# Altium project Control-Board-v1.0.PrjPcb (part 1 of 6)
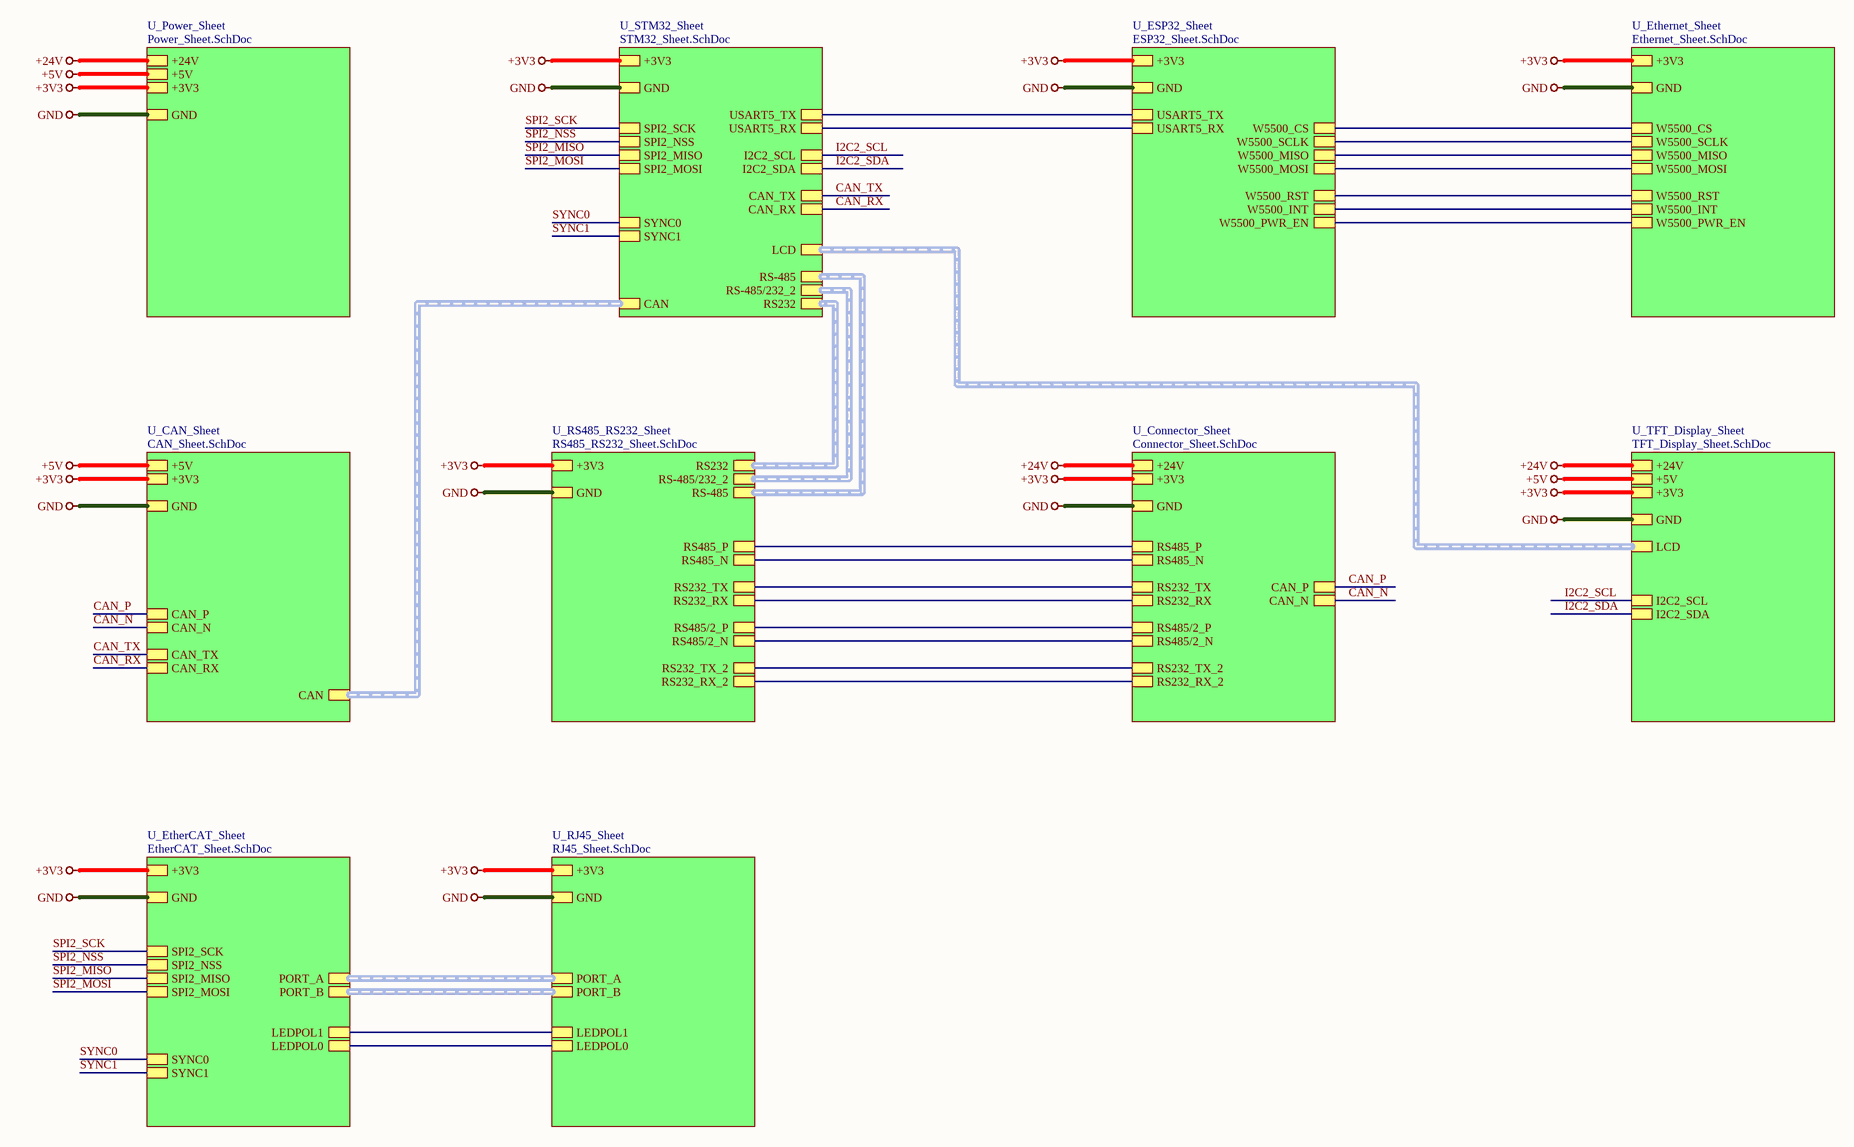
[diagram p0: Top_Sheet.SchDoc]
11 sheets, 286 parts. Net scope: hierarchical (ports join the sheet entries above them; power ports are global).
Sheets:
  Top_Sheet.SchDoc
    U_CAN_Sheet = CAN_Sheet.SchDoc
    U_Connector_Sheet = Connector_Sheet.SchDoc
    U_ESP32_Sheet = ESP32_Sheet.SchDoc
    U_EtherCAT_Sheet = EtherCAT_Sheet.SchDoc
    U_Ethernet_Sheet = Ethernet_Sheet.SchDoc
    U_Power_Sheet = Power_Sheet.SchDoc
    U_RJ45_Sheet = RJ45_Sheet.SchDoc
    U_RS485_RS232_Sheet = RS485_RS232_Sheet.SchDoc
    U_STM32_Sheet = STM32_Sheet.SchDoc
    U_TFT_Display_Sheet = TFT_Display_Sheet.SchDoc

## Sheet Top_Sheet.SchDoc
size 420 x 297 mm; SheetNumber: 1; SheetTotal: 11

### Sub-sheets
U_CAN_Sheet = CAN_Sheet.SchDoc: CAN (harness CAN), CAN_RX, CAN_TX, CAN_P, CAN_N, +5V, +3V3, GND
U_Connector_Sheet = Connector_Sheet.SchDoc: RS485/2_N, RS485/2_P, RS232_RX_2, RS232_TX_2, RS485_N, RS485_P, RS232_RX, RS232_TX, CAN_P, CAN_N, +3V3, GND, +24V
U_ESP32_Sheet = ESP32_Sheet.SchDoc: +3V3, GND, W5500_SCLK, W5500_MISO, W5500_MOSI, W5500_RST, W5500_INT, W5500_CS, W5500_PWR_EN, USART5_TX, USART5_RX
U_EtherCAT_Sheet = EtherCAT_Sheet.SchDoc: PORT_A (harness PORT_A), PORT_B (harness PORT_B), LEDPOL0, LEDPOL1, SPI2_SCK, SPI2_NSS, SPI2_MISO, SPI2_MOSI, +3V3, GND, SYNC1, SYNC0
U_Ethernet_Sheet = Ethernet_Sheet.SchDoc: W5500_SCLK, W5500_MISO, W5500_MOSI, W5500_RST, W5500_INT, W5500_CS, W5500_PWR_EN, +3V3, GND
U_Power_Sheet = Power_Sheet.SchDoc: +24V, +5V, +3V3, GND
U_RJ45_Sheet = RJ45_Sheet.SchDoc: PORT_A (harness PORT_A), PORT_B (harness PORT_B), LEDPOL0, LEDPOL1, +3V3, GND
U_RS485_RS232_Sheet = RS485_RS232_Sheet.SchDoc: RS485_N, RS485_P, RS232_RX, RS232_TX, RS-485 (harness RS-485), +3V3, GND, RS485/2_N, RS485/2_P, RS232_RX_2, RS232_TX_2, RS-485/232_2 (harness RS-485/232_2), RS232 (harness RS232)
U_STM32_Sheet = STM32_Sheet.SchDoc: SPI2_SCK, SPI2_NSS, SPI2_MISO, SPI2_MOSI, RS-485/232_2 (harness RS-485/232_2), RS232 (harness RS232), +3V3, GND, USART5_TX, USART5_RX, RS-485 (harness RS-485), CAN_RX, CAN_TX, CAN (harness CAN), LCD (harness TFT_LCD), I2C2_SCL, I2C2_SDA, SYNC1, SYNC0
U_TFT_Display_Sheet = TFT_Display_Sheet.SchDoc: +3V3, GND, LCD (harness TFT_LCD), +24V, I2C2_SCL, I2C2_SDA, +5V

### Nets
+3V3: sheet U_CAN_Sheet/+3V3, sheet U_Connector_Sheet/+3V3, sheet U_ESP32_Sheet/+3V3, sheet U_EtherCAT_Sheet/+3V3, sheet U_Ethernet_Sheet/+3V3, sheet U_Power_Sheet/+3V3, sheet U_RJ45_Sheet/+3V3, sheet U_RS485_RS232_Sheet/+3V3, sheet U_STM32_Sheet/+3V3, sheet U_TFT_Display_Sheet/+3V3
+5V: sheet U_CAN_Sheet/+5V, sheet U_Power_Sheet/+5V, sheet U_TFT_Display_Sheet/+5V
+24V: sheet U_Connector_Sheet/+24V, sheet U_Power_Sheet/+24V, sheet U_TFT_Display_Sheet/+24V
CAN_RX: sheet U_CAN_Sheet/CAN_RX, sheet U_STM32_Sheet/CAN_RX
CAN_TX: sheet U_CAN_Sheet/CAN_TX, sheet U_STM32_Sheet/CAN_TX
GND: sheet U_CAN_Sheet/GND, sheet U_Connector_Sheet/GND, sheet U_ESP32_Sheet/GND, sheet U_EtherCAT_Sheet/GND, sheet U_Ethernet_Sheet/GND, sheet U_Power_Sheet/GND, sheet U_RJ45_Sheet/GND, sheet U_RS485_RS232_Sheet/GND, sheet U_STM32_Sheet/GND, sheet U_TFT_Display_Sheet/GND
RS232_RX: sheet U_Connector_Sheet/RS232_RX, sheet U_RS485_RS232_Sheet/RS232_RX
RS232_RX_2: sheet U_Connector_Sheet/RS232_RX_2, sheet U_RS485_RS232_Sheet/RS232_RX_2
RS232_TX: sheet U_Connector_Sheet/RS232_TX, sheet U_RS485_RS232_Sheet/RS232_TX
RS232_TX_2: sheet U_Connector_Sheet/RS232_TX_2, sheet U_RS485_RS232_Sheet/RS232_TX_2
W5500_RST: sheet U_ESP32_Sheet/W5500_RST, sheet U_Ethernet_Sheet/W5500_RST
CAN_N: sheet U_CAN_Sheet/CAN_N, sheet U_Connector_Sheet/CAN_N
CAN_P: sheet U_CAN_Sheet/CAN_P, sheet U_Connector_Sheet/CAN_P
I2C2_SCL: sheet U_STM32_Sheet/I2C2_SCL, sheet U_TFT_Display_Sheet/I2C2_SCL
I2C2_SDA: sheet U_STM32_Sheet/I2C2_SDA, sheet U_TFT_Display_Sheet/I2C2_SDA
LEDPOL0: sheet U_EtherCAT_Sheet/LEDPOL0, sheet U_RJ45_Sheet/LEDPOL0
LEDPOL1: sheet U_EtherCAT_Sheet/LEDPOL1, sheet U_RJ45_Sheet/LEDPOL1
RS485/2_N: sheet U_Connector_Sheet/RS485/2_N, sheet U_RS485_RS232_Sheet/RS485/2_N
RS485/2_P: sheet U_Connector_Sheet/RS485/2_P, sheet U_RS485_RS232_Sheet/RS485/2_P
RS485_N: sheet U_Connector_Sheet/RS485_N, sheet U_RS485_RS232_Sheet/RS485_N
RS485_P: sheet U_Connector_Sheet/RS485_P, sheet U_RS485_RS232_Sheet/RS485_P
SPI2_CS_IO5: sheet U_ESP32_Sheet/W5500_CS, sheet U_Ethernet_Sheet/W5500_CS
SPI2_MISO: sheet U_EtherCAT_Sheet/SPI2_MISO, sheet U_STM32_Sheet/SPI2_MISO
SPI2_MISO_IO1: sheet U_ESP32_Sheet/W5500_MISO, sheet U_Ethernet_Sheet/W5500_MISO
SPI2_MOSI: sheet U_EtherCAT_Sheet/SPI2_MOSI, sheet U_STM32_Sheet/SPI2_MOSI
SPI2_MOSI_IO2: sheet U_ESP32_Sheet/W5500_MOSI, sheet U_Ethernet_Sheet/W5500_MOSI
SPI2_NSS: sheet U_EtherCAT_Sheet/SPI2_NSS, sheet U_STM32_Sheet/SPI2_NSS
SPI2_SCK: sheet U_EtherCAT_Sheet/SPI2_SCK, sheet U_STM32_Sheet/SPI2_SCK
SPI2_SCK_IO4: sheet U_ESP32_Sheet/W5500_SCLK, sheet U_Ethernet_Sheet/W5500_SCLK
SYNC0: sheet U_EtherCAT_Sheet/SYNC0, sheet U_STM32_Sheet/SYNC0
SYNC1: sheet U_EtherCAT_Sheet/SYNC1, sheet U_STM32_Sheet/SYNC1
USART5_RX: sheet U_ESP32_Sheet/USART5_RX, sheet U_STM32_Sheet/USART5_RX
USART5_TX: sheet U_ESP32_Sheet/USART5_TX, sheet U_STM32_Sheet/USART5_TX
W5500_INT: sheet U_ESP32_Sheet/W5500_INT, sheet U_Ethernet_Sheet/W5500_INT
W5500_PWR_EN: sheet U_ESP32_Sheet/W5500_PWR_EN, sheet U_Ethernet_Sheet/W5500_PWR_EN

### Buses and harness runs
harness sheet U_CAN_Sheet/CAN = sheet U_STM32_Sheet/CAN
harness sheet U_EtherCAT_Sheet/PORT_A = sheet U_RJ45_Sheet/PORT_A
harness sheet U_EtherCAT_Sheet/PORT_B = sheet U_RJ45_Sheet/PORT_B
harness sheet U_RS485_RS232_Sheet/RS232 = sheet U_STM32_Sheet/RS232
harness sheet U_RS485_RS232_Sheet/RS-485 = sheet U_STM32_Sheet/RS-485
harness sheet U_RS485_RS232_Sheet/RS-485/232_2 = sheet U_STM32_Sheet/RS-485/232_2
harness sheet U_STM32_Sheet/LCD = sheet U_TFT_Display_Sheet/LCD

### Notes on the sheet
- File:
- Title:
- Date:
- Page
- Num:
- Total:
- Drawn By: Huzaifa Ali

## Sheet CAN_Sheet.SchDoc
size 420 x 297 mm; SheetNumber: 5; SheetTotal: 11
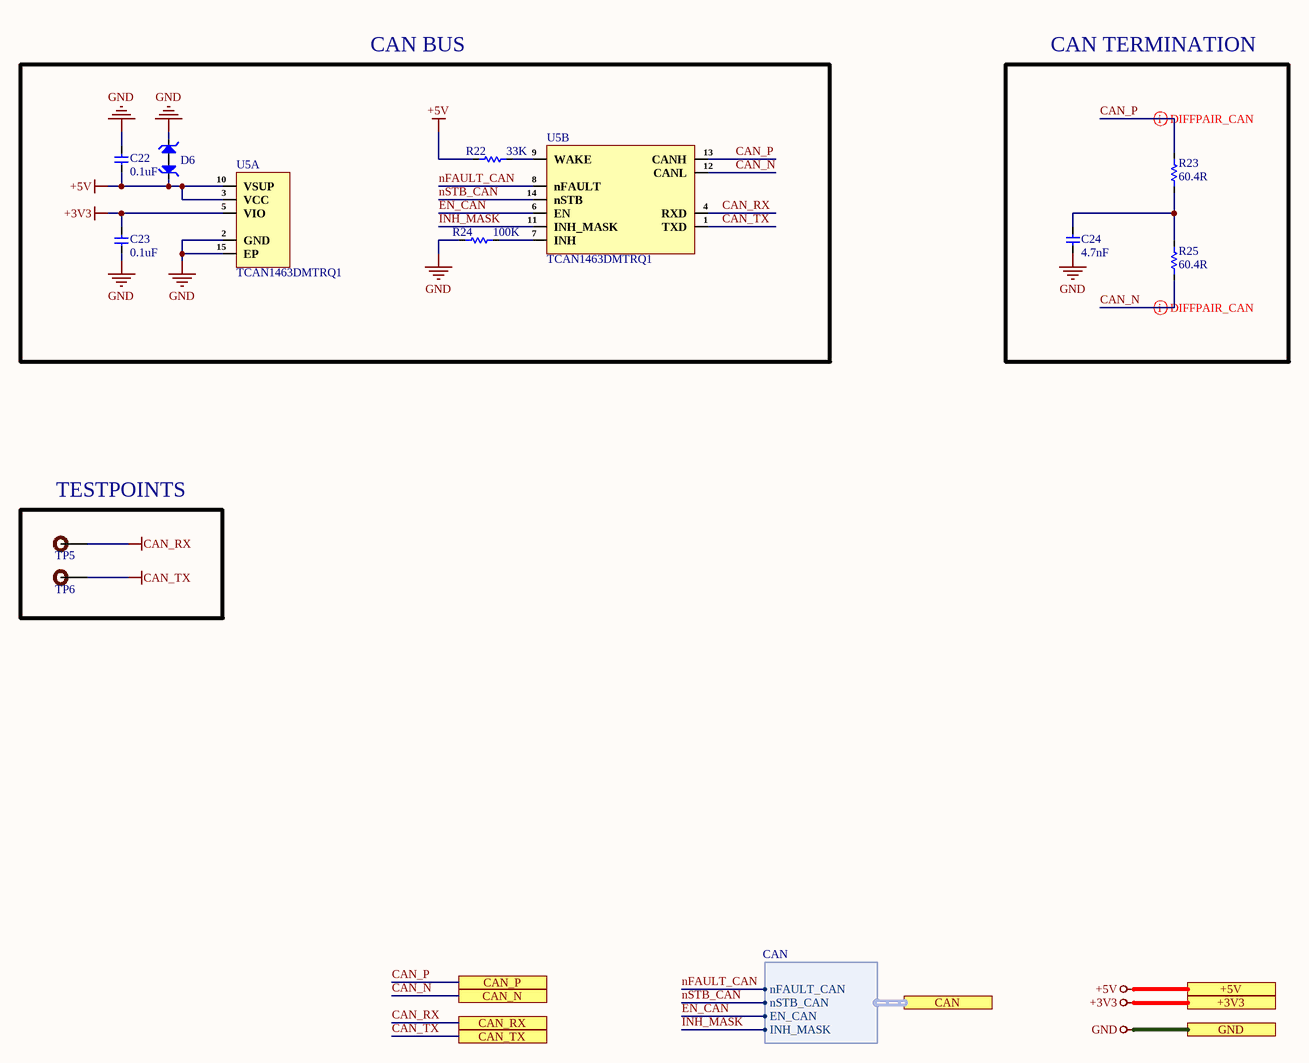
[diagram p1: CAN_Sheet.SchDoc]

### Parts
C22  0.1uF  [Cap-0402]
C23  0.1uF  [Cap-0402]
C24  4.7nF  [Cap-0402]
D6  PESD5V0H1BSFYL  [DSN0603-2]  (value not drawn)
R22  33K  [Res-0402]
R23  60.4R  [Res-0603]
R24  100K  [Res-0402]
R25  60.4R  [Res-0603]
TP5  TEST POINT  [Test-point]  (value not drawn)  (no BOM)
TP6  TEST POINT  [Test-point]  (value not drawn)  (no BOM)
U5  TCAN1463DMTRQ1  [VSON-14(3x4.5)]  (parts A,B of 2)

### Ports
+3V3 (see Top_Sheet[1B], Connector_Sheet[5D], ESP32_Sheet[5D], EtherCAT_Sheet[5D], Ethernet_Sheet[5D], Power_Sheet[5D], RJ45_Sheet[5D], RS485_RS232_Sheet[5D], STM32_Sheet[5D], TFT_Display_Sheet[5D]), +5V (see Top_Sheet[1B], Power_Sheet[5D]), CAN (harness CAN, see Top_Sheet[2C], STM32_Sheet[4D]), CAN_N (see Top_Sheet[1C], Connector_Sheet[3D]), CAN_P (see Top_Sheet[1C], Connector_Sheet[3D]), CAN_RX (see Top_Sheet[1C], STM32_Sheet[2D]), CAN_TX (see Top_Sheet[1C], STM32_Sheet[2D]), GND (see Top_Sheet[1B], Connector_Sheet[5D], ESP32_Sheet[5D], EtherCAT_Sheet[5D], Ethernet_Sheet[5D], Power_Sheet[5D], RJ45_Sheet[5D], RS485_RS232_Sheet[5D], STM32_Sheet[5D], TFT_Display_Sheet[5D])

### Harnesses
CAN: nFAULT_CAN, nSTB_CAN, EN_CAN, INH_MASK

### Nets
+3V3: C23.2 U5.5(VIO) ; port +3V3
+5V: C22.1 D6.1 R22.1 U5.3(VCC) U5.10(VSUP) ; port +5V
CAN_RX: TP5.1 U5.4(RXD) ; port CAN_RX
CAN_TX: TP6.1 U5.1(TXD) ; port CAN_TX
GND: C22.2 C23.1 C24.2 D6.2 R24.1 U5.2(GND) U5.15(EP) ; port GND
CAN_N: R25.2 U5.12(CANL) ; port CAN_N
CAN_P: R23.1 U5.13(CANH) ; port CAN_P
EN_CAN: U5.6(EN) ; port CAN.EN_CAN
INH_MASK: U5.11(INH_MASK) ; port CAN.INH_MASK
nFAULT_CAN: U5.8(nFAULT) ; port CAN.nFAULT_CAN
nSTB_CAN: U5.14(nSTB) ; port CAN.nSTB_CAN
NetC24_1: C24.1 R23.2 R25.1
NetR22_2: R22.2 U5.9(WAKE)
NetR24_2: R24.2 U5.7(INH)

### Layout directives
differential pair; net class CAN; differential pair class CAN_Lines: CAN_N, CAN_P

### Notes on the sheet
- CAN BUS
- CAN TERMINATION
- (near TP5) TESTPOINTS
- File:
- Title:
- Date:
- Page
- Num:
- Total:
- Drawn By: Huzaifa Ali

### Library data of the parts
C22 C23 = CC0402JRX7R7BB104: CAP CER 0.1UF 16V X7R 0402; Manufacturer: Yageo; Material: 4241ConductorMaterial; Value: 100nF; Tolerance: 5%; Item Type: Capacitor; Supplier: Digikey; Supplier Part Number: 311-1676-1-ND; Manufacturer Part Number: CC0402JRX7R7BB104; RoHS: Yes; Category: Ceramic Capacitors; Stock: 1659111; Pricing: 1=0.1, 10=0.046, 50=0.0262, 100=0.0203, 500=0.01528, 1000=0.012, 2500=0.01091, 5000=0.01004 (USD); Mounting Technology: Surface Mount; Case/Package: 0402; Case Code (Metric): 1005; Case Code (Imperial): 0402; Min Operating Temperature: -55°C; Max Operating Temperature: 125°C; Dielectric: X7R; Packaging: Tape and Reel; Package Quantity: 10000; Voltage Rating (DC): 16V; Voltage Rating: 16V; Series: CC; Construction: Flat; Length: 0.039inch; Width: 0.02inch; Height: 0.5mm; Thickness: 0.022inch; Lead Free: Lead Free; Halogen Free: Halogen Free; RoHS Compliant: Yes; ComponentLink1URL: https://datasheet.ciiva.com/13210/upy-gphc-x7r-6-3v-to-50v-8-12304-13210152.pdf?src-supplier=Mouser; ComponentLink1Description: https://datasheet.ciiva.com/13210/upy-gphc-x7r-6-3v-to-50v-8-12304-13210152.pdf?src-supplier=Mouser; LCSC Part Number: C541464
C24 = CC0402KRX7R9BB472: CAP CER 4700PF 50V X7R 0402; Manufacturer: Yageo; Material: 4241ConductorMaterial; Tolerance: 10%; Temperature Coefficient: 30ppm/°C; Item Type: Capacitor; Supplier 1: Future Electronics; Manufacturer Part Number: CC0402KRX7R9BB472; RoHS: Yes; Category: Ceramic Capacitors; Stock 1: 1780000; Pricing 1: 10000=0.0021, 40000=0.002, 150000=0.0019, 400000=0.0018, 1000000=0.0017 (USD); Mount: Surface Mount; Case/Package: 0402; Number of Pins: 2NUMBER; Case Code (Imperial): 0402; Case Code (Metric): 1005; Min Operating Temperature: -55°C; Max Operating Temperature: 125°C; Capacitance: 4.7nF; Dielectric: X7R; Voltage Rating: 50V; Voltage Rating (DC): 50V; Packaging: Tape and Reel; Package Quantity: 1; Termination: SMD/SMT; Series: CC; Construction: Flat; Length: 1mm; Width: 0.02inch; Height: 0.5mm; Thickness: 0.022inch; Depth: 0.5mm; Radiation Hardening: No; Reach SVHC Compliant: No; RoHS Compliant: Yes; Halogen Free: 5694HalogenFree; Lead Free: 5697LeadFree; ComponentLink1URL: https://datasheet.ciiva.com/7978/1489800-7978108.pdf?src-supplier=Element14; ComponentLink1Description: https://datasheet.ciiva.com/7978/1489800-7978108.pdf?src-supplier=Element14; ComponentLink2URL: https://datasheet.ciiva.com/176/mlccorderingcode-176364.pdf?src-supplier=Digikey; ComponentLink2Description: https://datasheet.ciiva.com/176/mlccorderingcode-176364.pdf?src-supplier=Digikey; ComponentLink3URL: https://datasheet.ciiva.com/176/mlccorderingcode-176363.pdf?src-supplier=Digikey; ComponentLink3Description: https://datasheet.ciiva.com/176/mlccorderingcode-176363.pdf?src-supplier=Digikey; ComponentLink4URL: https://datasheet.ciiva.com/176/mlccorderingcode-176365.pdf?src-supplier=Digikey; ComponentLink4Description: https://datasheet.ciiva.com/176/mlccorderingcode-176365.pdf?src-supplier=Digikey; ComponentLink5URL: https://datasheet.ciiva.com/11586/upy-gphc-x7r-6-3v-to-50v-8-11586491.pdf?src-supplier=Avnet; ComponentLink5Description: https://datasheet.ciiva.com/11586/upy-gphc-x7r-6-3v-to-50v-8-11586491.pdf?src-supplier=Avnet; Supplier Part Number 1: 1989300
D6 = PESD5V0H1BSFYL: TVS DIODE 5VWM 6.3VC DSN0603-2; Manufacturer: Nexperia; Supplier 1: Avnet; Manufacturer Part Number: PESD5V0H1BSFYL; RoHS: Yes; Category: ESD and Circuit Protection ICs; Stock 1: 9000; Pricing 1: 18000=0.06453, 36000=0.06278, 54000=0.06104, 90000=0.05930, 180000=0.05755, 900000=0.05581, 1800000=0.05406 (USD); RoHS Compliant: Yes; ComponentLink1URL: http://www.farnell.com/datasheets/1961312.pdf?src-supplier=Farnell; ComponentLink1Description: http://www.farnell.com/datasheets/1961312.pdf?src-supplier=Farnell; ComponentLink2URL: https://assets.nexperia.com/documents/data-sheet/PESD5V0H1BSF.pdf?src-supplier=Digi-Key; ComponentLink2Description: https://assets.nexperia.com/documents/data-sheet/PESD5V0H1BSF.pdf?src-supplier=Digi-Key; ComponentLink3URL: http://www.farnell.com/datasheets/1961312.pdf?src-supplier=Newark; ComponentLink3Description: http://www.farnell.com/datasheets/1961312.pdf?src-supplier=Newark; Supplier Part Number 1: PESD5V0H1BSFYL; LCSC Part Number: C477989; Item Type: Diode
R22 = RC0402FR-0733KL: RES 33K OHM 1% 1/16W 0402; Manufacturer: YAGEO; Item Type: Resistor; Manufacturer Part Number: RC0402FR-0733KL; Package: 0402; LCSC Part Number: C138003; ComponentLink1Description: LCSC; ComponentLink1URL: https://www.lcsc.com/product-detail/Chip-Resistor-Surface-Mount_YAGEO-RC0402FR-0733KL_C138003.html
R23 R25 = RTT0360R4FTP: 100mW Thick Film Resistors ±100ppm/℃ ±1% 60.4Ω 0603 Chip Resistor - Surface Mount ROHS; Manuacturer: RALEC; Manufacturer Part Number: RTT0360R4FTP; Package: 0603; Value: 60.4R; LCSC Part Number: C103744; ComponentLink1Description: LCSC; ComponentLink1URL: https://www.lcsc.com/product-detail/Chip-Resistor-Surface-Mount_RALEC-RTT0360R4FTP_C103744.html
R24 = RC0402FR-07100KL: RES 100K OHM 1% 1/16W 0402; Manufacturer: Yageo; Resistance: 100kR; Temperature Coefficient: 100ppm/°C; Power Rating: 63mW; Voltage Rating: 50V; Item Type: Resistor; Supplier 1: Mouser; Manufacturer Part Number: RC0402FR-07100KL; RoHS: Yes; Category: Chip SMD Resistors; Stock 1: 7759549; Pricing 1: 1=0.10000, 10=0.01200, 50=0.01200, 100=0.00500, 1000=0.00300, 2500=0.00200, 10000=0.00100 (USD); Case/Package: 0402; Case Code (Metric): 1005; Case Code (Imperial): 0402; Min Operating Temperature: -55°C; Max Operating Temperature: 155°C; Resistor Type: Thick Film; Tolerance: 1%; Packaging: Tape and Reel; Package Quantity: 1; Number of Terminations: 2; Termination: SMD/SMT; Max Power Dissipation: 63mW; Working Voltage: 50V; Features: Moisture Resistant; Series: RC; Resistance Tolerance: 1%; Construction: Rectangular; Technology: THICK FILM; Length: 0.039inch; Width: 0.02inch; Height: 0.016inch; Depth: 0.5mm; REACH SVHC: No SVHC; Lead Free: Lead Free; RoHS Compliant: Yes; Military Standard: Not; ComponentLink1URL: https://datasheet.ciiva.com/11819/0900766b80c66297-11819452.pdf?src-supplier=RSComponents; ComponentLink1Description: https://datasheet.ciiva.com/11819/0900766b80c66297-11819452.pdf?src-supplier=RSComponents; ComponentLink2URL: https://datasheet.ciiva.com/22747/1018594-22747509.pdf?src-supplier=Element14; ComponentLink2Description: https://datasheet.ciiva.com/22747/1018594-22747509.pdf?src-supplier=Element14; ComponentLink3URL: https://datasheet.ciiva.com/2453/pyu-r-int-thick-7-2453362.pdf?src-supplier=Digi-Key; ComponentLink3Description: https://datasheet.ciiva.com/2453/pyu-r-int-thick-7-2453362.pdf?src-supplier=Digi-Key; ComponentLink4URL: https://datasheet.ciiva.com/2453/pyu-r-int-thick-7-2453363.pdf?src-supplier=Digi-Key; ComponentLink4Description: https://datasheet.ciiva.com/2453/pyu-r-int-thick-7-2453363.pdf?src-supplier=Digi-Key; ComponentLink5URL: https://datasheet.ciiva.com/2453/pyu-r-int-thick-7-2453361.pdf?src-supplier=Digi-Key; ComponentLink5Description: https://datasheet.ciiva.com/2453/pyu-r-int-thick-7-2453361.pdf?src-supplier=Digi-Key; ComponentLink6URL: https://datasheet.ciiva.com/12667/pyu-rc0402-51-rohs-l-6-r-12667930.pdf?src-supplier=Mouser; ComponentLink6Description: https://datasheet.ciiva.com/12667/pyu-rc0402-51-rohs-l-6-r-12667930.pdf?src-supplier=Mouser; ComponentLink7URL: https://datasheet.ciiva.com/15189/getdatasheetpartid-323696-15189334.pdf?src-supplier=Verical; ComponentLink7Description: https://datasheet.ciiva.com/15189/getdatasheetpartid-323696-15189334.pdf?src-supplier=Verical; Supplier Part Number 1: 603-RC0402FR-07100KL; LCSC Part Number: C60491
TP5 TP6 = TEST POINT: Test Point ON; Item Type: TEST POINT
U5 = TCAN1463DMTRQ1: IC TRANSCEIVER HALF 1/1 14VSON; Manufacturer: Texas Instruments; Supplier: Mouser; Supplier Part Number: 595-TCAN1463DMTRQ1; Manufacturer Part Number: TCAN1463DMTRQ1; RoHS: Yes; Item Type: IC; Stock: 20610; Pricing: 1=2.47, 10=2.22, 50=2.22, 100=1.78, 1000=1.21, 10000=1.09 (USD); LCSC Part Number: C5215823

## Sheet Connector_Sheet.SchDoc
size 420 x 297 mm; SheetNumber: 11; SheetTotal: 11
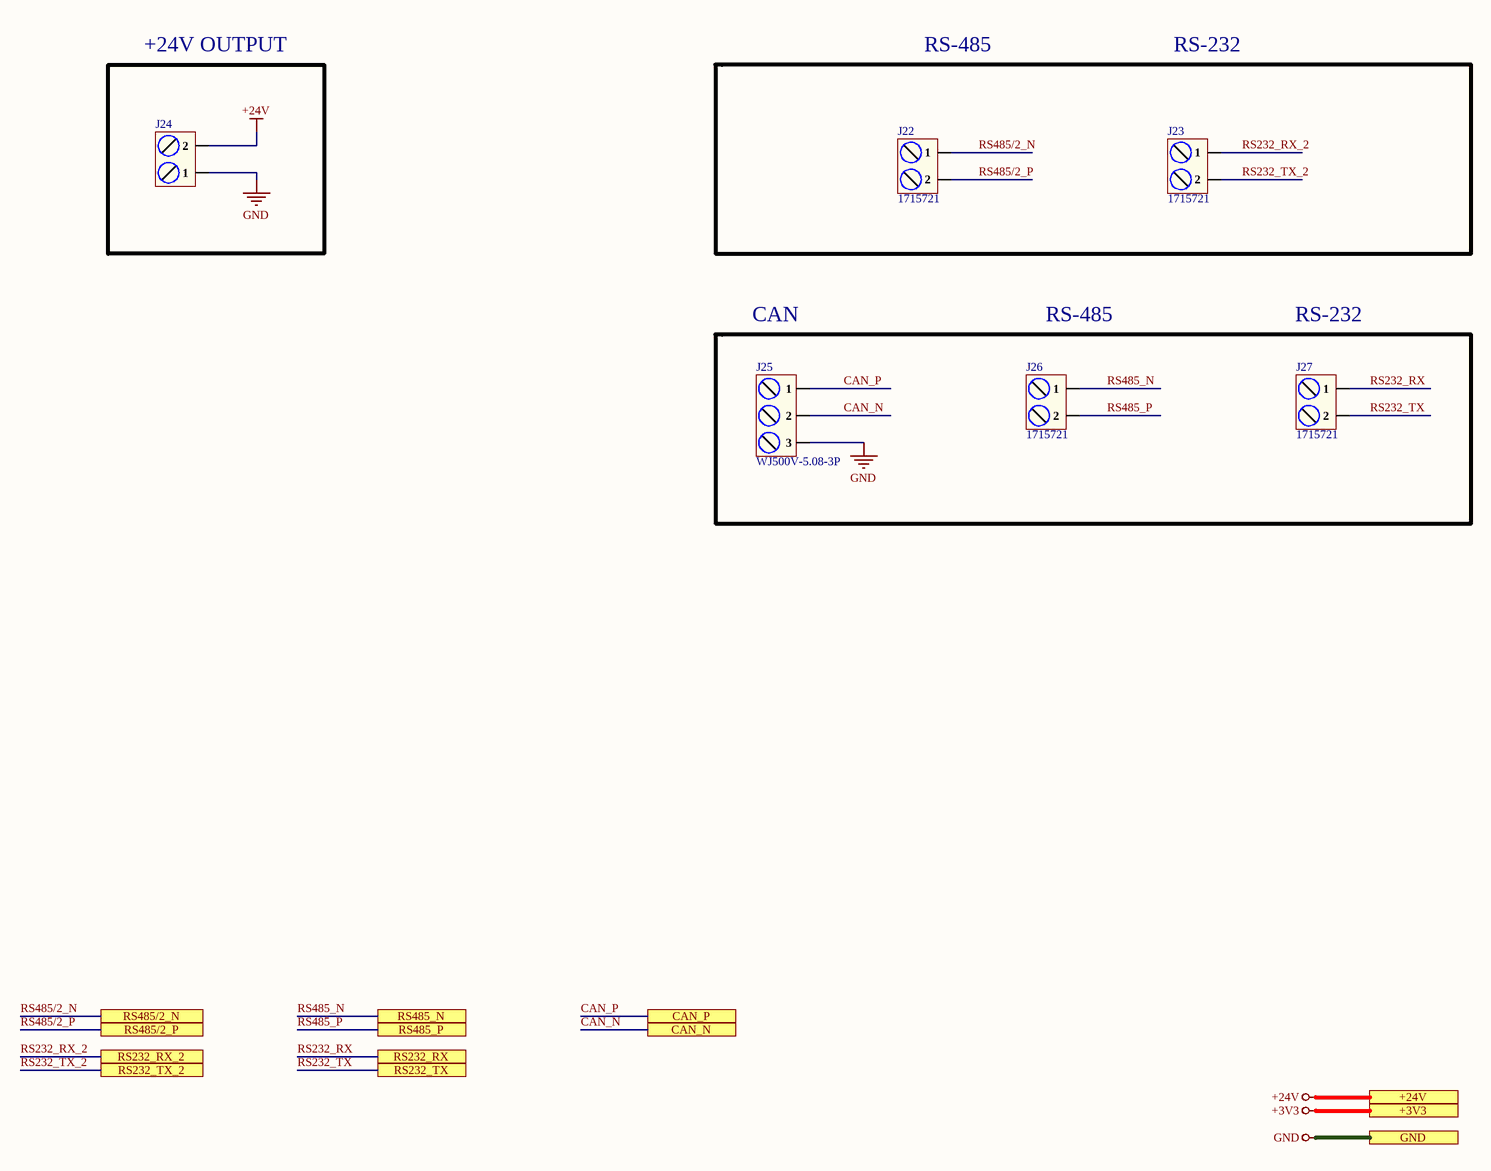
[diagram p2: Connector_Sheet.SchDoc]

### Parts
J22  1715721  [1715721]
J23  1715721  [1715721]
J24  MXHB9500-9.5-02P-BK01-Cu-S-A  [MXHB9500-9.5-02P-BK01-Cu-S-A]  (value not drawn)
J25  WJ500V-5.08-3P  [WJ500V-5.08-3P]
J26  1715721  [1715721]
J27  1715721  [1715721]

### Ports
+3V3 (see Top_Sheet[4B], CAN_Sheet[5D], ESP32_Sheet[5D], EtherCAT_Sheet[5D], Ethernet_Sheet[5D], Power_Sheet[5D], RJ45_Sheet[5D], RS485_RS232_Sheet[5D], STM32_Sheet[5D], TFT_Display_Sheet[5D]), +24V (see Top_Sheet[4B], Power_Sheet[5D]), CAN_N (see Top_Sheet[4B], CAN_Sheet[3D]), CAN_P (see Top_Sheet[4B], CAN_Sheet[3D]), GND (see Top_Sheet[4B], CAN_Sheet[5D], ESP32_Sheet[5D], EtherCAT_Sheet[5D], Ethernet_Sheet[5D], Power_Sheet[5D], RJ45_Sheet[5D], RS485_RS232_Sheet[5D], STM32_Sheet[5D], TFT_Display_Sheet[5D]), RS232_RX (see Top_Sheet[4B], RS485_RS232_Sheet[2D]), RS232_RX_2 (see Top_Sheet[4C], RS485_RS232_Sheet[1D]), RS232_TX (see Top_Sheet[4B], RS485_RS232_Sheet[2D]), RS232_TX_2 (see Top_Sheet[4C], RS485_RS232_Sheet[1D]), RS485/2_N (see Top_Sheet[4C], RS485_RS232_Sheet[1D]), RS485/2_P (see Top_Sheet[4C], RS485_RS232_Sheet[1D]), RS485_N (see Top_Sheet[4B], RS485_RS232_Sheet[2D]), RS485_P (see Top_Sheet[4B], RS485_RS232_Sheet[2D])

### Nets
+24V: J24.2 ; port +24V
GND: J24.1 J25.3 ; port GND
RS232_RX: J27.1 ; port RS232_RX
RS232_RX_2: J23.1 ; port RS232_RX_2
RS232_TX: J27.2 ; port RS232_TX
RS232_TX_2: J23.2 ; port RS232_TX_2
CAN_N: J25.2 ; port CAN_N
CAN_P: J25.1 ; port CAN_P
RS485/2_N: J22.1 ; port RS485/2_N
RS485/2_P: J22.2 ; port RS485/2_P
RS485_N: J26.1 ; port RS485_N
RS485_P: J26.2 ; port RS485_P

### Notes on the sheet
- +24V OUTPUT
- RS-485
- RS-232
- CAN
- File:
- Title:
- Date:
- Page
- Num:
- Total:
- Drawn By: Huzaifa Ali

### Library data of the parts
J22 J23 J26 J27 = 1715721: TERM BLK 2P SIDE ENT 5.08MM PCB; Manufacturer: Phoenix Contact; Item Type: Terminal Blocks; Supplier: Digikey; Supplier Part Number: 277-1263-ND; Manufacturer Part Number: 1715721; RoHS: Yes; Stock: 13160; Pricing: 1=0.94 (USD); ComponentLink1URL: https://datasheet.ciiva.com/1120/1697161-1120393.pdf?src-supplier=Farnell; ComponentLink1Description: https://datasheet.ciiva.com/1120/1697161-1120393.pdf?src-supplier=Farnell; ComponentLink2URL: https://datasheet.ciiva.com/832/1715721-832095.pdf?src-supplier=Digikey; ComponentLink2Description: https://datasheet.ciiva.com/832/1715721-832095.pdf?src-supplier=Digikey; ComponentLink3URL: https://datasheet.ciiva.com/15169/getdatasheetpartid-212174-15169929.pdf?src-supplier=Verical; ComponentLink3Description: https://datasheet.ciiva.com/15169/getdatasheetpartid-212174-15169929.pdf?src-supplier=Verical; ComponentLink4URL: https://datasheet.ciiva.com/16046/1715721-16046034.pdf?src-supplier=Onlinecomponents.com; ComponentLink4Description: https://datasheet.ciiva.com/16046/1715721-16046034.pdf?src-supplier=Onlinecomponents.com
J24 = MXHB9500-9.5-02P-BK01-Cu-S-A: Tin 1x2P Corner pin Three sides 2 1 9.5mm -40℃~+105℃ 20A 300V Black 10~22 Copper Alloy 0.5~4 Plugin,P=9.5mm Barrier Terminal Blocks ROHS; Manufacturer: MAX; Manufacturer Part Number: MXHB9500-9.5-02P-BK01-Cu-S-A; Package: Plugin,P=9.5mm; LCSC Part Number: C7542168; Item Type: Terminal Block; ComponentLink1Description: LCSC; ComponentLink1URL: https://www.lcsc.com/product-detail/Barrier-Terminal-Blocks_MAX-MXHB9500-9-5-02P-BK01-Cu-S-A_C7542168.html
J25 = WJ500V-5.08-3P: 1x3P 18A -40℃~+105℃ 250V Green 14~30 Straight pin 5.08mm 2.5 1 3 Plugin,P=5.08mm Screw terminal ROHS; Manufacturer: Ningbo Kangnex Elec; Item Type: Terminal Block; Manufacturer Part Number: WJ500V-5.08-3P; Package: Plugin,P=5.08mm; LCSC Part Number: C72334; ComponentLink1Description: LCSC; ComponentLink1URL: https://www.lcsc.com/product-detail/Screw-terminal_Ningbo-Kangnex-Elec-WJ500V-5-08-3P_C72334.html

## Sheet ESP32_Sheet.SchDoc
size 420 x 297 mm; SheetNumber: 3; SheetTotal: 11
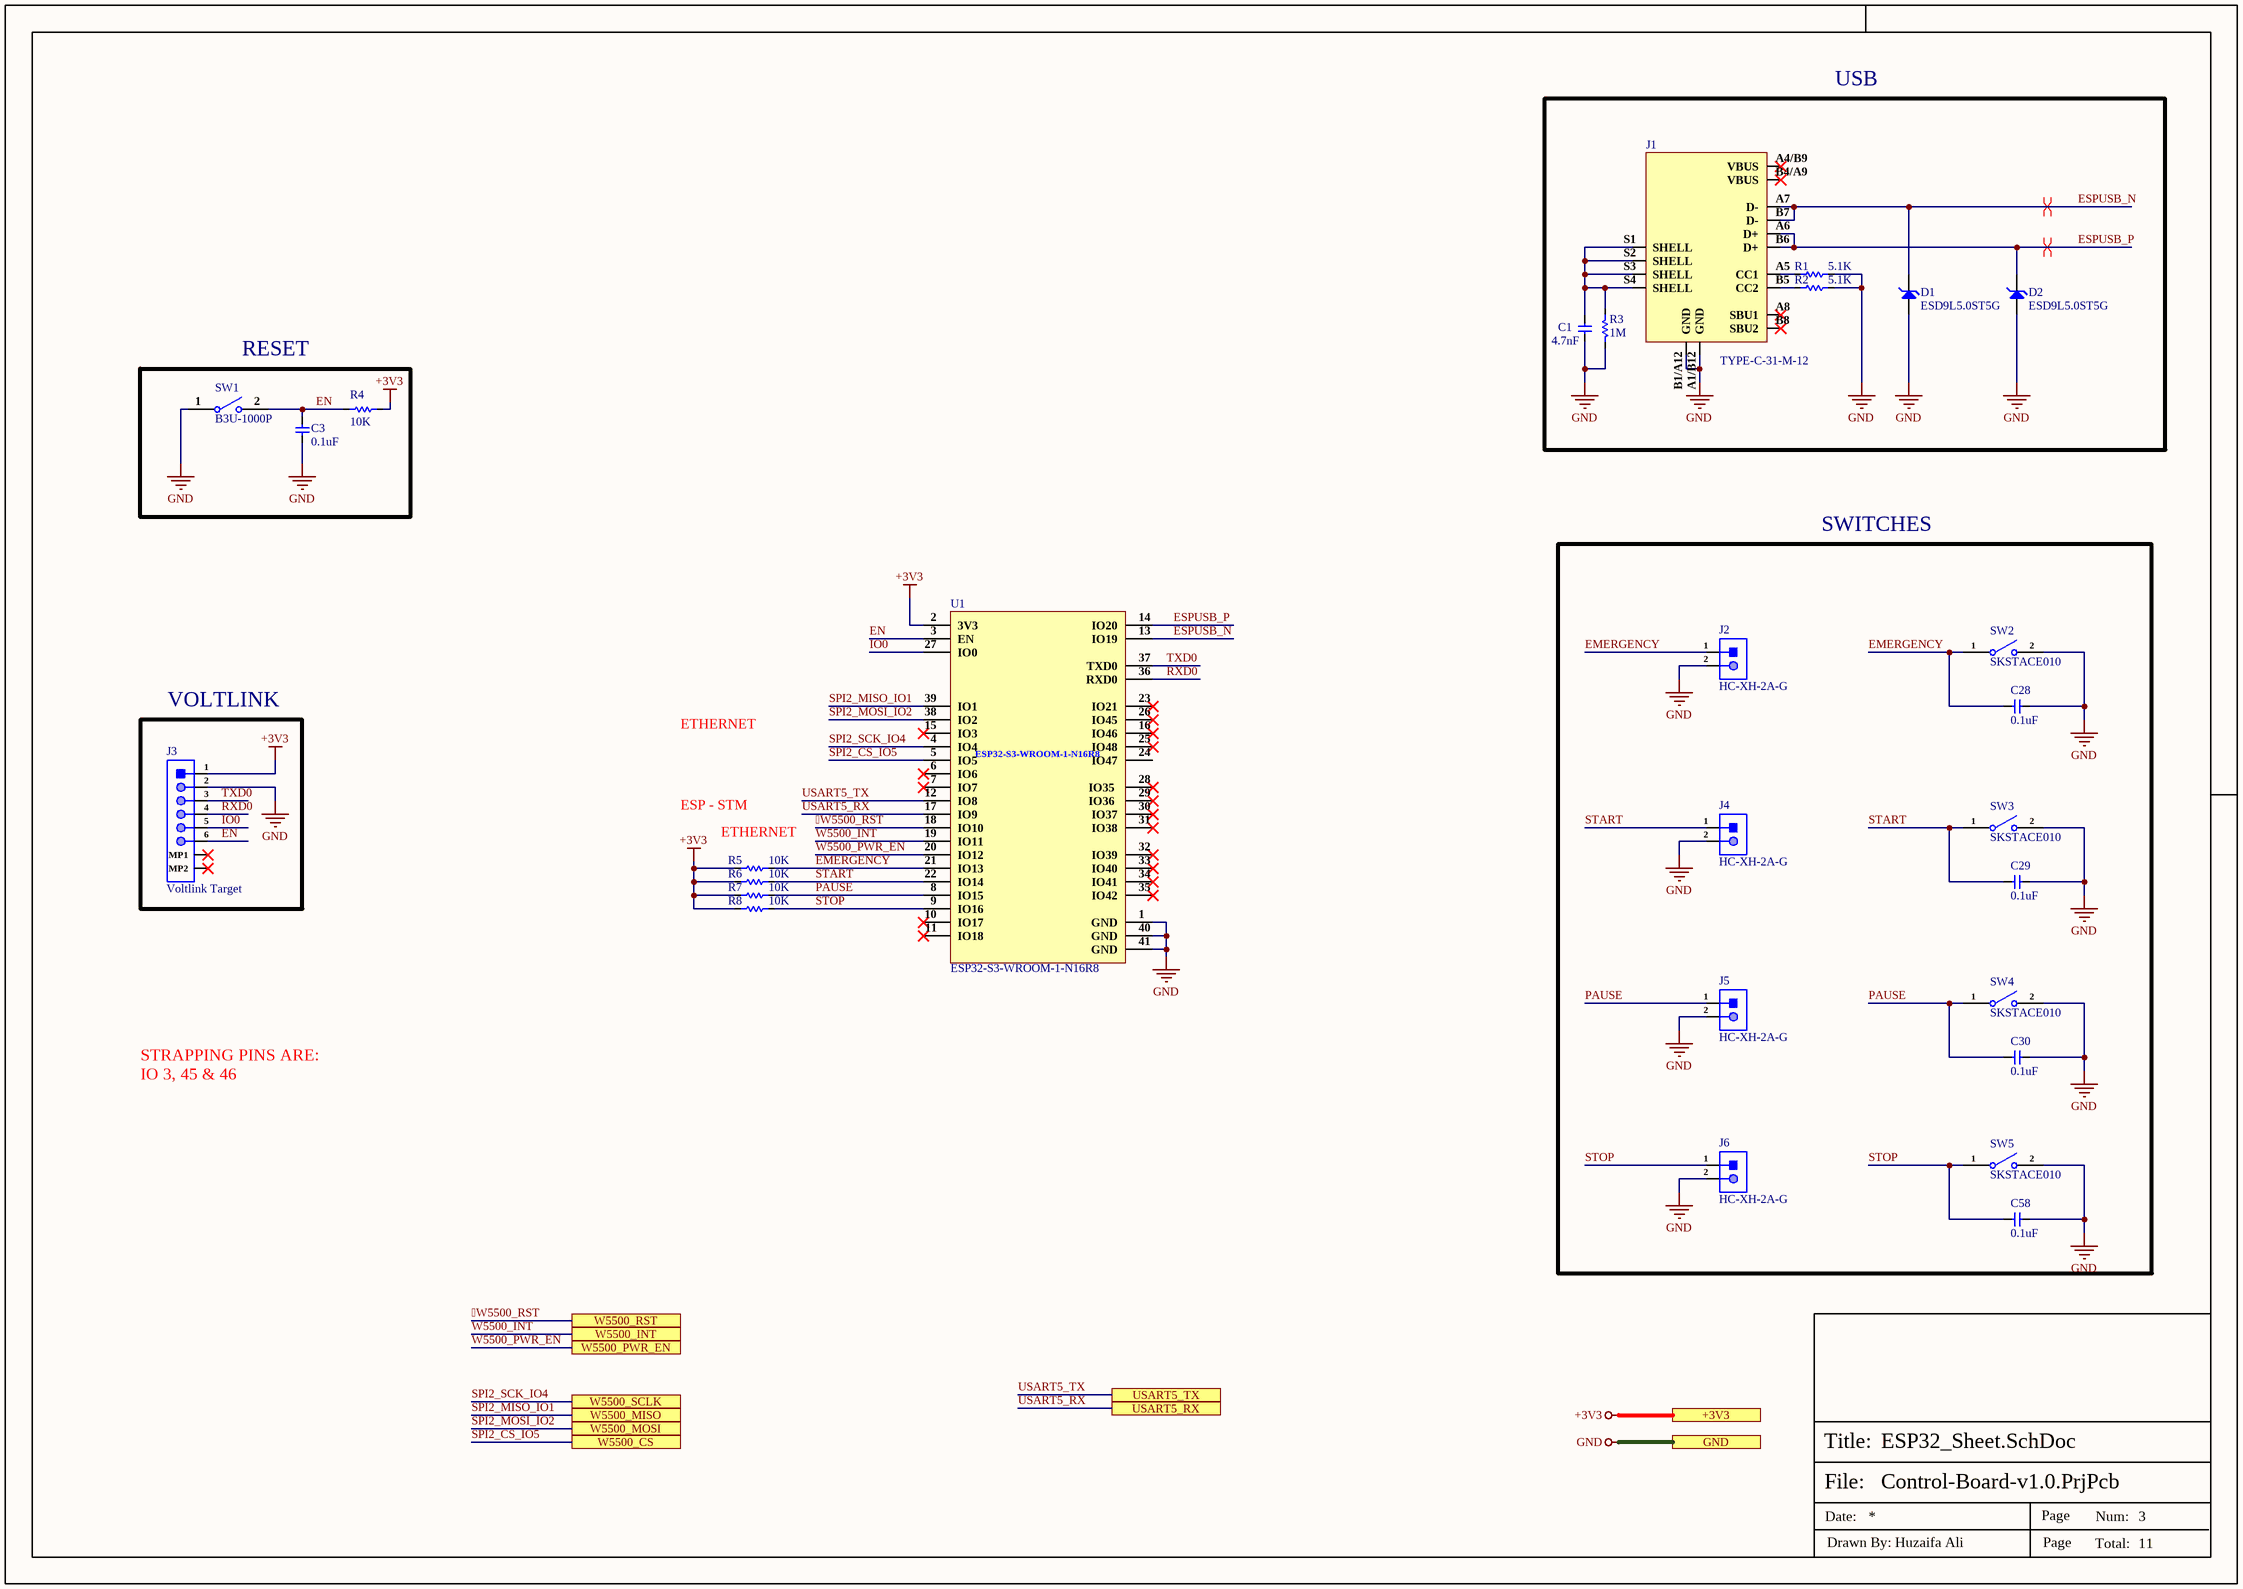
[diagram p3: ESP32_Sheet.SchDoc]

### Parts
C1  4.7nF  [Cap-0603]
C3  0.1uF  [Cap-0402]
C28  0.1uF  [Cap-0402]
C29  0.1uF  [Cap-0402]
C30  0.1uF  [Cap-0402]
C58  0.1uF  [Cap-0402]
D1  ESD9L5.0ST5G  [SOD-923.]
D2  ESD9L5.0ST5G  [SOD-923.]
J1  TYPE-C-31-M-12  [TYPE-C-31-M-12_]
J2  HC-XH-2A-G  [HC-XH-2A-G]
J3  Voltlink Target  [Voltlink Target]
J4  HC-XH-2A-G  [HC-XH-2A-G]
J5  HC-XH-2A-G  [HC-XH-2A-G]
J6  HC-XH-2A-G  [HC-XH-2A-G]
R1  5.1K  [Res-0402]
R2  5.1K  [Res-0402]
R3  1M  [Res-0402]
R4  10K  [Res-0402]
R5  10K  [Res-0402]
R6  10K  [Res-0402]
R7  10K  [Res-0402]
R8  10K  [Res-0402]
SW1  B3U-1000P  [B3U-1000P]
SW2  SKSTACE010  [SKSTACE010_]
SW3  SKSTACE010  [SKSTACE010_]
SW4  SKSTACE010  [SKSTACE010_]
SW5  SKSTACE010  [SKSTACE010_]
U1  ESP32-S3-WROOM-1-N16R8  [41-SMD Module]

### Blocks framed on the sheet
USB: C1 D1 D2 J1 R1-R3
RESET: C3 R4 SW1
SWITCHES: C28-C30 C58 J2 J4-J6 SW2-SW5
VOLTLINK: J3

### Ports
+3V3 (see Top_Sheet[4A], CAN_Sheet[5D], Connector_Sheet[5D], EtherCAT_Sheet[5D], Ethernet_Sheet[5D], Power_Sheet[5D], RJ45_Sheet[5D], RS485_RS232_Sheet[5D], STM32_Sheet[5D], TFT_Display_Sheet[5D]), GND (see Top_Sheet[4A], CAN_Sheet[5D], Connector_Sheet[5D], EtherCAT_Sheet[5D], Ethernet_Sheet[5D], Power_Sheet[5D], RJ45_Sheet[5D], RS485_RS232_Sheet[5D], STM32_Sheet[5D], TFT_Display_Sheet[5D]), USART5_RX (see Top_Sheet[4A], STM32_Sheet[3D]), USART5_TX (see Top_Sheet[4A], STM32_Sheet[3D]), W5500_CS (see Top_Sheet[4A], Ethernet_Sheet[2D]), W5500_INT (see Top_Sheet[4A], Ethernet_Sheet[3D]), W5500_MISO (see Top_Sheet[4A], Ethernet_Sheet[2D]), W5500_MOSI (see Top_Sheet[4A], Ethernet_Sheet[2D]), W5500_PWR_EN (see Top_Sheet[4B], Ethernet_Sheet[3D]), W5500_RST (see Top_Sheet[4A], Ethernet_Sheet[3D]), W5500_SCLK (see Top_Sheet[4A], Ethernet_Sheet[2D])

### Nets
+3V3: J3.1 R4.2 R5.1 R6.1 R7.1 R8.1 U1.2(3V3) ; port +3V3
GND: C1.1 C3.1 C28.1 C29.1 C30.1 C58.1 D1.2(A) D2.2(A) J1.A1/B12(GND) J1.B1/A12(GND) J2.2 J3.2 J4.2 J5.2 J6.2 R1.2 R2.2 R3.2 SW1.1 SW2.2 SW3.2 SW4.2 SW5.2 U1.1(GND) U1.40(GND) U1.41(GND) ; port GND
W5500_RST: U1.18(IO10) ; port W5500_RST
EMERGENCY: C28.2 J2.1 R5.2 SW2.1 U1.21(IO13)
EN: C3.2 J3.6 R4.1 SW1.2 U1.3(EN)
ESPUSB_N: D1.1(K) J1.A7(D-) J1.B7(D-) U1.13(IO19)
ESPUSB_P: D2.1(K) J1.A6(D+) J1.B6(D+) U1.14(IO20)
IO0: J3.5 U1.27(IO0)
PAUSE: C30.2 J5.1 R7.2 SW4.1 U1.8(IO15)
RXD0: J3.4 U1.36(RXD0)
SPI2_CS_IO5: U1.5(IO5) ; port W5500_CS
SPI2_MISO_IO1: U1.39(IO1) ; port W5500_MISO
SPI2_MOSI_IO2: U1.38(IO2) ; port W5500_MOSI
SPI2_SCK_IO4: U1.4(IO4) ; port W5500_SCLK
START: C29.2 J4.1 R6.2 SW3.1 U1.22(IO14)
STOP: C58.2 J6.1 R8.2 SW5.1 U1.9(IO16)
TXD0: J3.3 U1.37(TXD0)
USART5_RX: U1.17(IO9) ; port USART5_RX
USART5_TX: U1.12(IO8) ; port USART5_TX
W5500_INT: U1.19(IO11) ; port W5500_INT
W5500_PWR_EN: U1.20(IO12) ; port W5500_PWR_EN
NetC1_2: C1.2 J1.S1(SHELL) J1.S2(SHELL) J1.S3(SHELL) J1.S4(SHELL) R3.1
NetJ1_A5: J1.A5(CC1) R1.1
NetJ1_B5: J1.B5(CC2) R2.1

Not connected (* = marked no-connect by the designer): J1 A4/B9(VBUS)* A8(SBU1)* B4/A9(VBUS)* B8(SBU2)*; J3 MP1* MP2*; U1 6(IO6)* 7(IO7)* 10(IO17)* 11(IO18)* 15(IO3)* 16(IO46)* 23(IO21)* 24(IO47) 25(IO48)* 26(IO45)* 28(IO35_)* 29(IO36_)* 30(IO37)* 31(IO38)* 32(IO39)* 33(IO40)* 34(IO41)* 35(IO42)*

### Layout directives
differential pair; net class USB_PROGRAM; differential pair class USB_PROGRAM_LINES; rule Impedance Constraint [Min = 85.00    Max = 90.00    ]; rule Matched Net Lengths [Tolerance = 50mil]: ESPUSB_N, ESPUSB_P

### Notes on the sheet
- ETHERNET
- ESP - STM
- STRAPPING PINS ARE:
  IO 3, 45 & 46
- File:
- Title:
- Date:
- Page
- Num:
- Total:
- Drawn By: Huzaifa Ali

### Library data of the parts
C1 = CC0603JRNPO9BN472: CAP CER 4700PF 50V C0G/NPO 0603; Manufacturer: Yageo; Item Type: Capacitor; Supplier 1: Digi-Key; Manufacturer Part Number: CC0603JRNPO9BN472; RoHS: Yes; Category: Ceramic Capacitors; Stock 1: 31779; Pricing 1: 1=0.48000, 10=0.33000, 50=0.23100, 100=0.19800, 500=0.14854, 1000=0.12543 (USD); RoHS Compliant: Yes; Supplier Part Number 1: 13-CC0603JRNPO9BN472CT-ND; LCSC Part Number: C576818; ComponentLink1Description: LCSC; ComponentLink1URL: https://www.lcsc.com/product-detail/Multilayer-Ceramic-Capacitors-MLCC-SMD-SMT_YAGEO-CC0603JRNPO9BN472_C576818.html
C3 C28-C30 C58 = CC0402JRX7R7BB104: as C22 on sheet CAN_Sheet; Supplier: Digikey; Supplier Part Number: 311-1676-1-ND; Manufacturer Part Number: CC0402JRX7R7BB104; RoHS: Yes; Category: Ceramic Capacitors; Stock: 1659111; Pricing: 1=0.1, 10=0.046, 50=0.0262, 100=0.0203, 500=0.01528, 1000=0.012, 2500=0.01091, 5000=0.01004 (USD); Mounting Technology: Surface Mount; Case/Package: 0402; Case Code (Metric): 1005; Case Code (Imperial): 0402; Min Operating Temperature: -55°C; Max Operating Temperature: 125°C; Dielectric: X7R; Packaging: Tape and Reel; Package Quantity: 10000; Voltage Rating (DC): 16V; Voltage Rating: 16V; Series: CC; Construction: Flat; Length: 0.039inch; Width: 0.02inch; Height: 0.5mm; Thickness: 0.022inch; Lead Free: Lead Free; Halogen Free: Halogen Free; RoHS Compliant: Yes; ComponentLink1URL: https://datasheet.ciiva.com/13210/upy-gphc-x7r-6-3v-to-50v-8-12304-13210152.pdf?src-supplier=Mouser; ComponentLink1Description: https://datasheet.ciiva.com/13210/upy-gphc-x7r-6-3v-to-50v-8-12304-13210152.pdf?src-supplier=Mouser; LCSC Part Number: C541464
D1 D2 = ESD9L5.0ST5G: TVS DIODE 5V 9.8V SOD923; Manufacturer: ON Semiconductor; Capacitance: 0.9pF; Direction: Unidirectional; Number of Unidirectional Channels: 1; Min Breakdown Voltage: 5.4V; Power Line Protection: No; Leakage Current: 1uA; Element Configuration: Single; Peak Pulse Current: 1A; Diode Type: ZENER; Reverse Breakdown Voltage: 5.8V; Peak Pulse Power: 150mW; ESD Protection: Yes; Test Current: 1mA; Supplier 1: Digi-Key; Manufacturer Part Number: ESD9L5.0ST5G; RoHS: Yes; Category: ESD and Circuit Protection ICs; Stock 1: 558996; Pricing 1: 1=0.37000, 10=0.25600, 100=0.12500, 500=0.10426, 1000=0.07244, 2000=0.06278 (USD); Case/Package: SOD-923-2; Number of Pins: 2; Contact Plating: Tin,Matte; Min Operating Temperature: -55°C; Max Operating Temperature: 150°C; Package Quantity: 1; Packaging: Tape and Reel; Clamping Voltage: 9.8V; Reverse Standoff Voltage: 5V; Working Voltage: 5V; Resistor Type: Zener; Series: Automotive, AEC-Q101; Number of Elements: 1; Operating Supply Voltage: 5V; Max Surge Current: 1A; Breakdown Voltage: 5.4V; Number of Channels: 1; Polarity: Unidirectional; Termination: SMD/SMT; Max Reverse Leakage Current: 1uA; Max Breakdown Voltage: 5.4V; Number of Lines: 1; Power Dissipation: 150mW; Clamping Voltage-Max: 9.8V; Length: 0.8mm; Width: 0.65mm; Height: 0.4mm; Depth: 0.6mm; Radiation Hardening: No; Lead Free: Lead Free; RoHS Compliant: Yes; REACH SVHC: No SVHC; Halogen Free: Halogen Free; ComponentLink1URL: https://datasheet.ciiva.com/15143/getdatasheetpartid-185186-15143896.pdf?src-supplier=Verical; ComponentLink1Description: https://datasheet.ciiva.com/15143/getdatasheetpartid-185186-15143896.pdf?src-supplier=Verical; ComponentLink2URL: https://datasheet.ciiva.com/4510/esd9l-d-4510647.pdf?src-supplier=Mouser; ComponentLink2Description: https://datasheet.ciiva.com/4510/esd9l-d-4510647.pdf?src-supplier=Mouser; ComponentLink3URL: https://datasheet.ciiva.com/3304/esd9l-d-3304011.pdf?src-supplier=Avnet; ComponentLink3Description: https://datasheet.ciiva.com/3304/esd9l-d-3304011.pdf?src-supplier=Avnet; ComponentLink4URL: https://datasheet.ciiva.com/16437/esd9l-d-16437835.pdf?src-supplier=Future+Electronics; ComponentLink4Description: https://datasheet.ciiva.com/16437/esd9l-d-16437835.pdf?src-supplier=Future+Electronics; ComponentLink5URL: https://datasheet.ciiva.com/339/esd9l-d-339853.pdf?src-supplier=Digi-Key; ComponentLink5Description: https://datasheet.ciiva.com/339/esd9l-d-339853.pdf?src-supplier=Digi-Key; ComponentLink6URL: https://datasheet.ciiva.com/339/esd9l-d-339854.pdf?src-supplier=Digi-Key; ComponentLink6Description: https://datasheet.ciiva.com/339/esd9l-d-339854.pdf?src-supplier=Digi-Key; ComponentLink7URL: https://datasheet.ciiva.com/11195/esd9l-d-11195342.pdf?src-supplier=Avnet; ComponentLink7Description: https://datasheet.ciiva.com/11195/esd9l-d-11195342.pdf?src-supplier=Avnet; ComponentLink8URL: https://datasheet.ciiva.com/25958/esd9l-d-25958446.pdf?src-supplier=Avnet+Europe; ComponentLink8Description: https://datasheet.ciiva.com/25958/esd9l-d-25958446.pdf?src-supplier=Avnet+Europe; ComponentLink9URL: https://datasheet.ciiva.com/339/esd9l-d-339855.pdf?src-supplier=Digi-Key; ComponentLink9Description: https://datasheet.ciiva.com/339/esd9l-d-339855.pdf?src-supplier=Digi-Key; Supplier Part Number 1: ESD9L5.0ST5GOSCT-ND; LCSC Part Number: C82326
J1 = TYPE-C-31-M-12: 5A 1 16P Female Type-C SMD USB Connectors ROHS; Manufacturer: Korean Hroparts Elec; ComponentLink1Description: LCSC; ComponentLink1URL: https://www.lcsc.com/product-detail/USB-Connectors_Korean-Hroparts-Elec-TYPE-C-31-M-12_C165948.html; Manufacturer Part Number: TYPE-C-31-M-12; Footprint: Custom; LCSC Part Number: C165948; Item Type: USB Connector
J2 J4-J6 = HC-XH-2A-G: 1x2P XH 1 2.54mm 2.54mm Male pin 2 -25℃~+85℃ 3A Straight Straight,P=2.5mm Wire To Board / Wire To Wire Connector ROHS; Manufacturer: HCTL; Item Type: JST Connector; Manufacturer Part Number: HC-XH-2A-G; Package: Straight,P=2.5mm; LCSC Part Number: C5341201; ComponentLink1Description: LCSC; ComponentLink1URL: https://www.lcsc.com/product-detail/Wire-To-Board-Wire-To-Wire-Connector_HCTL-HC-XH-2A-G_C5341201.html
J3 = C145963: 1x6P SH 1 1mm 6 SMD,P=1mm Wire To Board / Wire To Wire Connector ROHS; Manufacturer: BOOMELE; Manufacturer Part Number: C145963; Package: SMD,P=1mm; LCSC Part Number: C145963; Item Type: Connector; ComponentLink1Description: LCSC; ComponentLink1URL: https://www.lcsc.com/product-detail/Wire-To-Board-Wire-To-Wire-Connector_BOOMELE-Boom-Precision-Elec-C145963_C145963.html
R1 R2 = RC0402FR-075K1L: RES 5.1K OHM 1% 1/16W 0402; Manufacturer: Yageo; Power Rating: 63mW; Resistance: 5.1kR; Temperature Coefficient: 100ppm/°C; Voltage Rating: 50V; Item Type: Resistor; Supplier 1: Avnet; Manufacturer Part Number: RC0402FR-075K1L; RoHS: Yes; Category: Chip SMD Resistors; Stock 1: 65000; Pricing 1: 10000=0.00085 (USD); Case/Package: 0402; Case Code (Metric): 1005; Case Code (Imperial): 0402; Min Operating Temperature: -55°C; Max Operating Temperature: 155°C; Tolerance: 1%; Technology: THICK FILM; Packaging: Tape and Reel; Package Quantity: 1; Resistor Type: Thick Film; Number of Terminations: 2; Termination: SMD/SMT; Max Power Dissipation: 63mW; Voltage Rating (DC): 50V; Working Voltage: 50V; Features: Moisture Resistant; Series: RC; Resistance Tolerance: 1%; Construction: Rectangular; Length: 1mm; Width: 0.02inch; Height: 0.016inch; Depth: 0.5mm; RoHS Compliant: Yes; Military Standard: Not; Lead Free: Lead Free; ComponentLink1URL: https://datasheet.ciiva.com/7983/1018594-7983519.pdf?src-supplier=Element14; ComponentLink1Description: https://datasheet.ciiva.com/7983/1018594-7983519.pdf?src-supplier=Element14; ComponentLink2URL: https://datasheet.ciiva.com/46394/1018594-46394936.pdf?src-supplier=Element14; ComponentLink2Description: https://datasheet.ciiva.com/46394/1018594-46394936.pdf?src-supplier=Element14; ComponentLink3URL: https://datasheet.ciiva.com/2453/pyu-r-int-thick-7-2453401.pdf?src-supplier=Digi-Key; ComponentLink3Description: https://datasheet.ciiva.com/2453/pyu-r-int-thick-7-2453401.pdf?src-supplier=Digi-Key; ComponentLink4URL: https://datasheet.ciiva.com/2453/pyu-r-int-thick-7-2453402.pdf?src-supplier=Digi-Key; ComponentLink4Description: https://datasheet.ciiva.com/2453/pyu-r-int-thick-7-2453402.pdf?src-supplier=Digi-Key; ComponentLink5URL: https://datasheet.ciiva.com/2453/pyu-r-int-thick-7-2453400.pdf?src-supplier=Digi-Key; ComponentLink5Description: https://datasheet.ciiva.com/2453/pyu-r-int-thick-7-2453400.pdf?src-supplier=Digi-Key; ComponentLink6URL: https://datasheet.ciiva.com/12558/pyu-rc0402-51-rohs-l-6-r-8721-12558460.pdf?src-supplier=Mouser; ComponentLink6Description: https://datasheet.ciiva.com/12558/pyu-rc0402-51-rohs-l-6-r-8721-12558460.pdf?src-supplier=Mouser; ComponentLink7URL: https://datasheet.ciiva.com/16744/pyu-rc0402-51-rohs-l-6-r-16744283.pdf?src-supplier=Future+Electronics; ComponentLink7Description: https://datasheet.ciiva.com/16744/pyu-rc0402-51-rohs-l-6-r-16744283.pdf?src-supplier=Future+Electronics; ComponentLink8URL: https://datasheet.ciiva.com/15189/getdatasheetpartid-323636-15189493.pdf?src-supplier=Verical; ComponentLink8Description: https://datasheet.ciiva.com/15189/getdatasheetpartid-323636-15189493.pdf?src-supplier=Verical; Supplier Part Number 1: RC0402FR-075K1L; LCSC Part Number: C105872
R3 = AF0402JR-071ML: RES SMD 1M OHM 5% 1/16W 0402; Manufacturer: Yageo; Resistance: 1MR; Max Power Dissipation: 63mW; Temperature Coefficient: 100ppm/°C; Item Type: Resistor; Supplier 1: Digi-Key; Manufacturer Part Number: AF0402JR-071ML; Stock 1: 0; Pricing 1: 10000=0.00408 (USD); Case/Package: 0402; Min Operating Temperature: -55°C; Max Operating Temperature: 155°C; Packaging: Tape and Reel; Resistor Type: Thick Film; Number of Terminations: 2; Tolerance: 5%; Features: Moisture Resistant,Anti-Sulfur; Length: 0.039inch; Width: 0.02inch; Height: 0.015inch; RoHS Compliant: Yes; ComponentLink1URL: https://www.yageo.com/upload/media/product/productsearch/datasheet/rchip/PYu-AF_51_RoHS_L_6.pdf?src-supplier=Digi-Key; ComponentLink1Description: https://www.yageo.com/upload/media/product/productsearch/datasheet/rchip/PYu-AF_51_RoHS_L_6.pdf?src-supplier=Digi-Key; Supplier Part Number 1: AF0402JR-071ML-ND; LCSC Part Number: C144054
R4-R8 = RC0402FR-0710KL: RES 10K OHM 1% 1/16W 0402; Manufacturer: Yageo; Resistance: 10kR; Voltage Rating (DC): 50V; Temperature Coefficient: 100ppm/°C; Power Rating: 62.5mW; Max Power Dissipation: 63mW; Item Type: Resistor; Supplier 1: Mouser; Manufacturer Part Number: RC0402FR-0710KL; RoHS: Yes; Category: Chip SMD Resistors; Stock 1: 18648329; Pricing 1: 1=0.10000, 10=0.01400, 50=0.01400, 100=0.00500, 1000=0.00300, 10000=0.00200 (USD); Case/Package: 0402; Number of Pins: 2; Case Code (Imperial): 0402; Case Code (Metric): 1005; Min Operating Temperature: -55°C; Max Operating Temperature: 155°C; Resistor Type: Thick Film; Tolerance: 1%; Packaging: Tape and Reel; Voltage Rating: 50V; Termination: SMD/SMT; Working Voltage: 50V; Number of Terminations: 2; Features: Moisture Resistant; Series: RC; Resistance Tolerance: 1%; Construction: Rectangular; Length: 1mm; Width: 0.5mm; Height: 0.32mm; Depth: 0.5mm; Lead Pitch: 0.2mm; REACH SVHC: No SVHC; Lead Free: Lead Free; RoHS Compliant: Yes; Military Standard: Not; ComponentLink1URL: https://datasheet.ciiva.com/7660/38568-7660787.pdf?src-supplier=Element14; ComponentLink1Description: https://datasheet.ciiva.com/7660/38568-7660787.pdf?src-supplier=Element14; ComponentLink2URL: https://datasheet.ciiva.com/7849/1686128-7849814.pdf?src-supplier=Element14; ComponentLink2Description: https://datasheet.ciiva.com/7849/1686128-7849814.pdf?src-supplier=Element14; ComponentLink3URL: https://datasheet.ciiva.com/7983/1018594-7983486.pdf?src-supplier=Element14; ComponentLink3Description: https://datasheet.ciiva.com/7983/1018594-7983486.pdf?src-supplier=Element14; ComponentLink4URL: https://datasheet.ciiva.com/22747/1018594-22747512.pdf?src-supplier=Element14; ComponentLink4Description: https://datasheet.ciiva.com/22747/1018594-22747512.pdf?src-supplier=Element14; ComponentLink5URL: https://datasheet.ciiva.com/12667/pyu-rc0402-51-rohs-l-6-r-12667067.pdf?src-supplier=Mouser; ComponentLink5Description: https://datasheet.ciiva.com/12667/pyu-rc0402-51-rohs-l-6-r-12667067.pdf?src-supplier=Mouser; ComponentLink6URL: https://datasheet.ciiva.com/7849/1784430-7849813.pdf?src-supplier=Element14; ComponentLink6Description: https://datasheet.ciiva.com/7849/1784430-7849813.pdf?src-supplier=Element14; ComponentLink7URL: https://datasheet.ciiva.com/7849/1784430-7849815.pdf?src-supplier=Element14; ComponentLink7Description: https://datasheet.ciiva.com/7849/1784430-7849815.pdf?src-supplier=Element14; Supplier Part Number 1: 603-RC0402FR-0710KL; LCSC Part Number: C60490
SW1 = B3U-1000P: SWITCH TACTILE SPST-NO 0.05A 12V; Manufacturer: Omron; Mechanical Life: 200000Cycles; Operating Force: 1.5N; Throw Configuration: SPST; Current Rating: 50mA; Contact Resistance: 100mR; Illumination Type: Non-Illuminated,Illuminated; Switch Travel: 0.15mm; Switch Function: Off-Mom; Actuator Type: Standard; Actuator Length: 0.4mm; Ratings: Dust Proof,IP40; ComponentLink1URL: http://www.farnell.com/datasheets/60838.pdf?src-supplier=Farnell; ComponentLink1Description: http://www.farnell.com/datasheets/60838.pdf?src-supplier=Farnell; ComponentLink2URL: http://www.farnell.com/datasheets/60838.pdf?src-supplier=Element14; ComponentLink2Description: http://www.farnell.com/datasheets/60838.pdf?src-supplier=Element14; ComponentLink3URL: https://omronfs.omron.com/en_US/ecb/products/pdf/en-b3u.pdf?src-supplier=Digi-Key; ComponentLink3Description: https://omronfs.omron.com/en_US/ecb/products/pdf/en-b3u.pdf?src-supplier=Digi-Key; ComponentLink4URL: http://www.omron.com/ecb/products/pdf/en-b3u.pdf?src-supplier=Digi-Key; ComponentLink4Description: http://www.omron.com/ecb/products/pdf/en-b3u.pdf?src-supplier=Digi-Key; ComponentLink5URL: https://www.distrelec.biz/Web/Downloads/he/et/B3U_eng_datasheet.pdf?mime=application%2Fpdf&src-supplier=Distrelec; ComponentLink5Description: https://www.distrelec.biz/Web/Downloads/he/et/B3U_eng_datasheet.pdf?mime=application%2Fpdf&src-supplier=Distrelec; ComponentLink6URL: http://www.onlinecomponents.com/productFiles/mf-OM/en-b3u.pdf?src-supplier=Onlinecomponents.com; ComponentLink6Description: http://www.onlinecomponents.com/productFiles/mf-OM/en-b3u.pdf?src-supplier=Onlinecomponents.com; Supplier 1: Digi-Key; Manufacturer Part Number: B3U-1000P; Stock 1: 116454; Pricing 1: 1=1, 10=0.961, 25=0.9064, 50=0.7976, 100=0.7251, 250=0.68888, 500=0.67074, 1000=0.52571 (USD); Mount: Surface Mount; Weight: 0.000776oz; Contact Material: Silver; Min Operating Temperature: -25°C; Max Operating Temperature: 70°C; Packaging: Tape and Reel; Voltage Rating (DC): 12V; Package Quantity: 1; Max Current Rating: 50mA; Termination: SMD/SMT; Orientation: Straight; Max Voltage Rating (DC): 12V; Electrical Life: 200000Cycles; Insulation Resistance: 100MR; Contact Current Rating: 50mA; Length: 4mm; Height: 1.2mm; Depth: 2.5mm; Width: 3mm; REACH SVHC: Unknown; Lead Free: Lead Free; ComponentLink7URL: https://www.verical.com/server-webapp/html/getDatasheet?partID=552554&src-supplier=Verical; ComponentLink7Description: https://www.verical.com/server-webapp/html/getDatasheet?partID=552554&src-supplier=Verical; ComponentLink8URL: http://www.farnell.com/datasheets/1685550.pdf?src-supplier=Element14; ComponentLink8Description: http://www.farnell.com/datasheets/1685550.pdf?src-supplier=Element14; ComponentLink9URL: http://www.farnell.com/datasheets/2610940.pdf?src-supplier=Farnell; ComponentLink9Description: http://www.farnell.com/datasheets/2610940.pdf?src-supplier=Farnell; ComponentLink10URL: https://www.alliedelec.com/m/d/4c8a9ef82804fc3c241a13c1e298fd73.pdf?src-supplier=Allied+Electronics; ComponentLink10Description: https://www.alliedelec.com/m/d/4c8a9ef82804fc3c241a13c1e298fd73.pdf?src-supplier=Allied+Electronics; Supplier Part Number 1: SW1020DKR-ND; LCSC Part Number: C231329; Item Type: Switch
SW2-SW5 = SKSTACE010: Tactile Switches SMT Top Push 0.9mm 7N Trav 100m Yellow; Manufacturer: Alps Electric; Supplier 1: Mouser; Manufacturer Part Number: SKSTACE010; RoHS: Yes; Category: Tactile Switches; Stock 1: 1089; Pricing 1: 1=1.08000, 10=1.08000, 50=0.90100, 100=0.81900, 1000=0.76700, 10000=0.74100 (USD); RoHS Compliant: Yes; Supplier Part Number 1: 688-SKSTACE010; LCSC Part Number: C341731
U1 = ESP32-S3-WROOM-1-N16R8: SMD MODULE, ESP32-S3R8 WITH 3.3V; Manufacturer: Espressif Systems; Supplier 1: Digi-Key; Manufacturer Part Number: ESP32-S3-WROOM-1-N16R8; RoHS: No; Category: Uncategorized; Stock 1: 423; Pricing 1: 1=4.29000 (USD); Supplier Part Number 1: 1965-ESP32-S3-WROOM-1-N16R8CT-ND; LCSC Part Number: C2913202; Item Type: Module; ComponentLink1Description: LCSC; ComponentLink1URL: https://www.lcsc.com/product-detail/WiFi-Modules_Espressif-Systems-ESP32-S3-WROOM-1-N16R8_C2913202.html